# Altium project ASCII Keyboard.PrjPcb
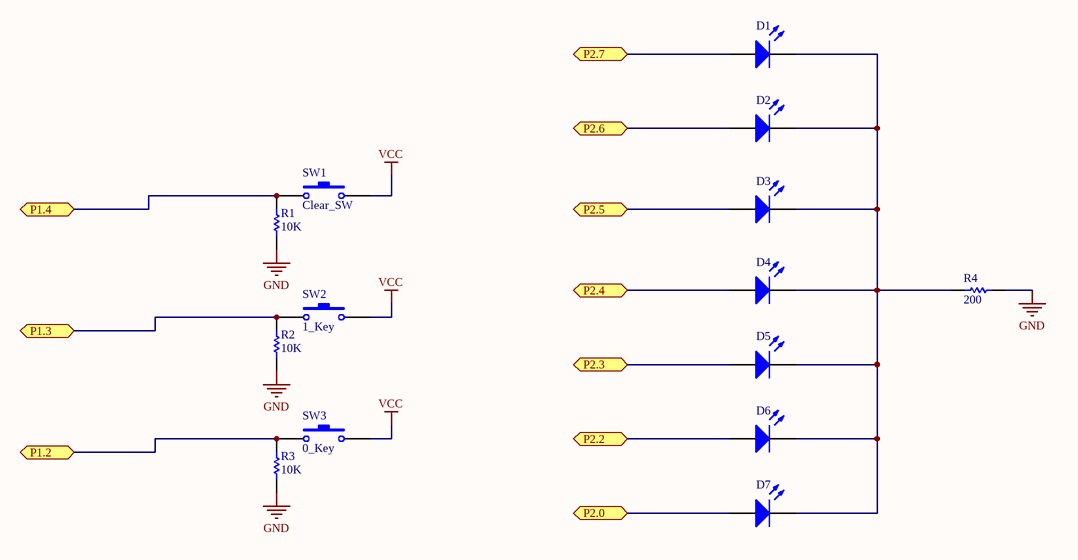
[diagram p0: ASCII_Keyboard.SchDoc]
1 sheet, 14 parts. Net scope: flat (ports and power ports of the same name join across sheets).

## Sheet ASCII_Keyboard.SchDoc: ASCII Keyboard
size A; DrawnBy: Dylan L.; Revision: 1

### Parts
D1  LED0  [LED-0]  (value not drawn)
D2  LED0  [LED-0]  (value not drawn)
D3  LED0  [LED-0]  (value not drawn)
D4  LED0  [LED-0]  (value not drawn)
D5  LED0  [LED-0]  (value not drawn)
D6  LED0  [LED-0]  (value not drawn)
D7  LED0  [LED-0]  (value not drawn)
R1  value 10K  [AXIAL-0.3]  (hidden comment: Res1)
R2  value 10K  [AXIAL-0.3]  (hidden comment: Res1)
R3  value 10K  [AXIAL-0.3]  (hidden comment: Res1)
R4  value 200  [AXIAL-0.3]  (hidden comment: Res1)
SW1  Clear_SW  [SPST-2]
SW2  1_Key  [SPST-2]
SW3  0_Key  [SPST-2]

### Ports
P1.2, P1.3, P1.4, P2.0, P2.2, P2.3, P2.4, P2.5, P2.6, P2.7

### Nets
GND: R1.2 R2.2 R3.2 R4.2
VCC: SW1.2 SW2.2 SW3.2
NetD1_1: D1.1(A) ; port P2.7
NetD1_2: D1.2(K) D2.2(K) D3.2(K) D4.2(K) D5.2(K) D6.2(K) D7.2(K) R4.1
NetD2_1: D2.1(A) ; port P2.6
NetD3_1: D3.1(A) ; port P2.5
NetD4_1: D4.1(A) ; port P2.4
NetD5_1: D5.1(A) ; port P2.3
NetD6_1: D6.1(A) ; port P2.2
NetD7_1: D7.1(A) ; port P2.0
NetR1_1: R1.1 SW1.1 ; port P1.4
NetR2_1: R2.1 SW2.1 ; port P1.3
NetR3_1: R3.1 SW3.1 ; port P1.2

### Library data of the parts
D1-D7 = LED0: Typical INFRARED GaAs LED; Published: 8-Jun-2000; LatestRevisionDate: 08-Jul-2005; LatestRevisionNote: Mech Layer 1 removed.; PackageReference: LED-0; Publisher: Altium Limited; PackageDescription: LED; 2 Leads
R1-R4 = Res1: Resistor; Published: 8-Jun-2000; LatestRevisionDate: 17-Jul-2002; LatestRevisionNote: Re-released for DXP Platform.; PackageReference: AXIAL-0.3; Publisher: Altium Limited; PackageDescription: Axial Device, Thru-Hole; 2 Leads; 0.3 in Pin Spacing
SW1-SW3 = SW-PB: Switch; Published: 24-Mar-1999; LatestRevisionDate: 17-Jul-2002; LatestRevisionNote: Re-released for DXP Platform.; PackageReference: SPST-2; Publisher: Altium Limited; PackageDescription: Switch; 2 Leads